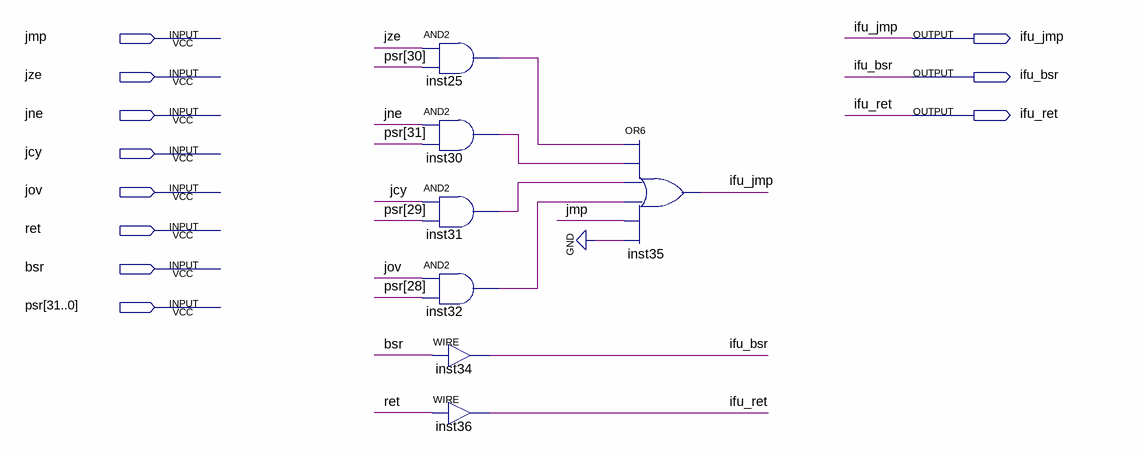
[diagram p0: schematic sheet]
// Quartus schematic uc_ifu.bdf as structural Verilog: 7 symbols, 11 pins
module uc_ifu (
  input  jmp,
  input  jze,
  input  jne,
  input  jcy,
  input  jov,
  input  ret,
  input  bsr,
  input  [31:0] psr,
  output ifu_jmp,
  output ifu_bsr,
  output ifu_ret
);

  wire inst25_out, inst30_out, inst31_out, inst32_out;

  and inst25 (inst25_out, jze, psr[30]);
  and inst30 (inst30_out, jne, psr[31]);
  and inst31 (inst31_out, jcy, psr[29]);
  and inst32 (inst32_out, jov, psr[28]);
  assign ifu_bsr = bsr;  // WIRE inst34
  assign ifu_ret = ret;  // WIRE inst36
  or inst35 (ifu_jmp, inst25_out, inst30_out, inst31_out, inst32_out, jmp, 1'b0);
endmodule
